# EAGLE design ctrl-brd (EAGLE 7.4.0)
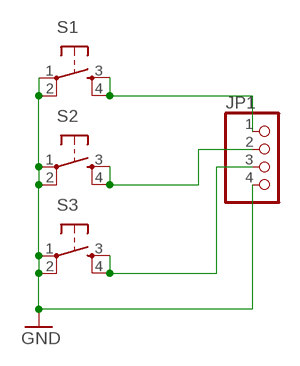
[diagram p0: schematic, sheet 1]

## Parts
JP1  PINHD-1X4  [1X04]
S1  6MM_SWITCH6MM_SWITCH  [6MM_SWITCH]
S2  6MM_SWITCH6MM_SWITCH  [6MM_SWITCH]
S3  6MM_SWITCH6MM_SWITCH  [6MM_SWITCH]

## Nets
GND: JP1.4 S1.1(P) S1.2(P1) S2.1(P) S2.2(P1) S3.1(P) S3.2(P1)
N$4: JP1.1 S1.3(S) S1.4(S1)
N$5: JP1.2 S2.3(S) S2.4(S1)
N$6: JP1.3 S3.3(S) S3.4(S1)

## Library data of the parts
JP1 = pinhead:PINHD-1X4: PIN HEADER
S1-S3 = fab:6MM_SWITCH: OMRON SWITCH

## Board
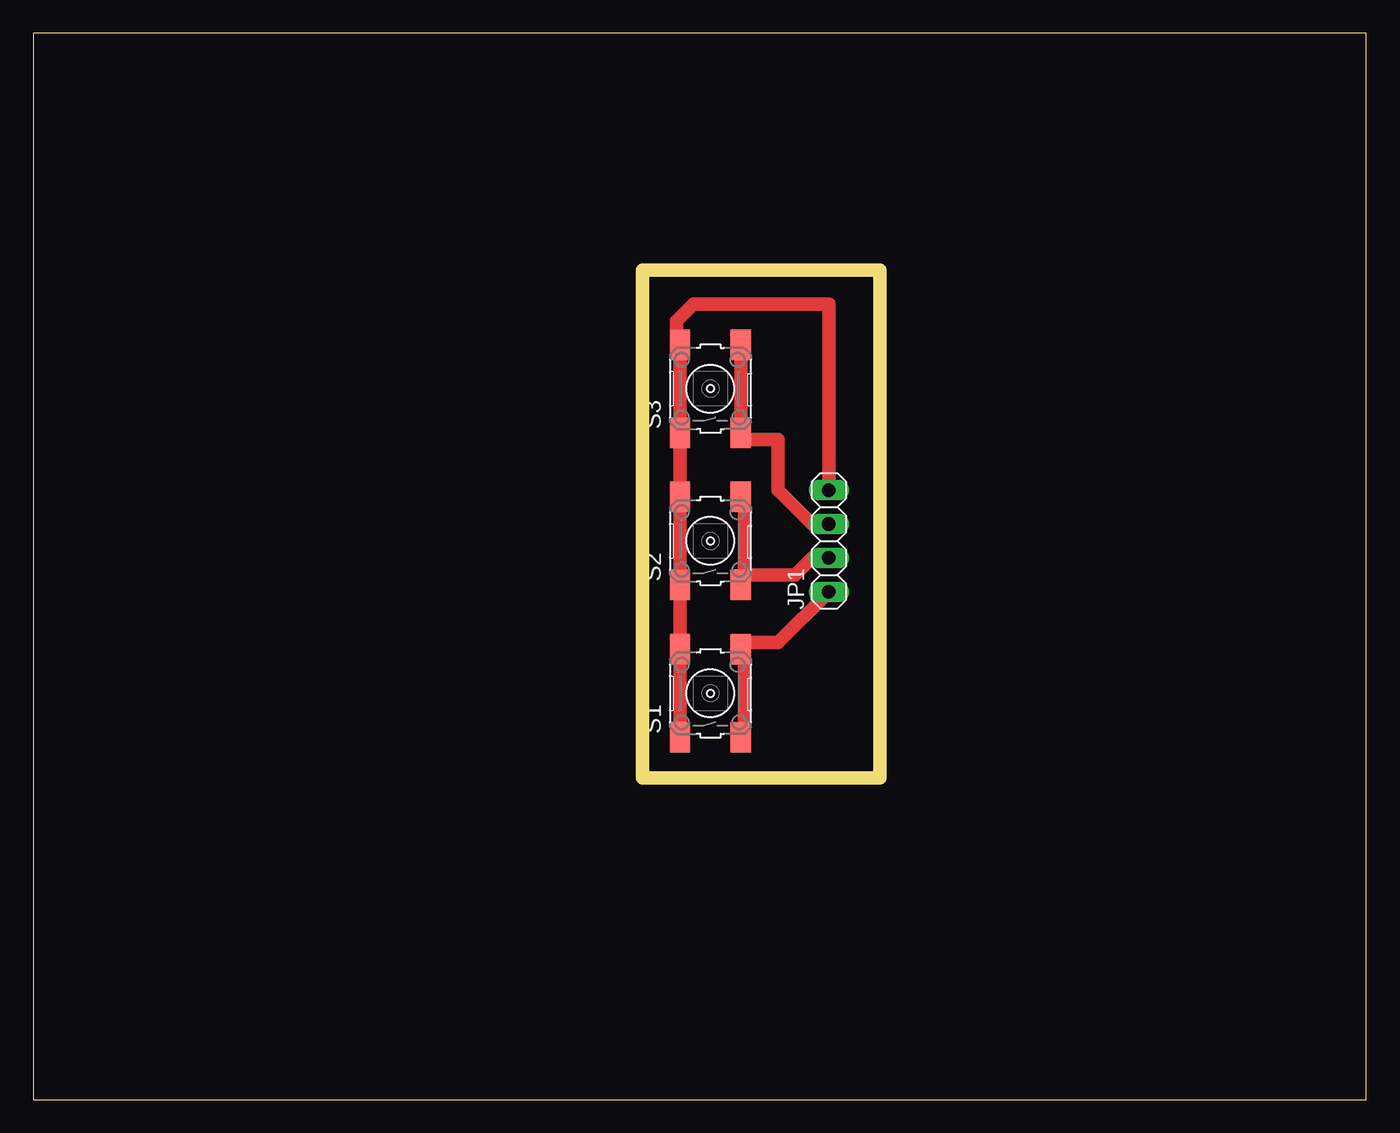
[diagram p1: board, top side]

Size 100 x 80 mm. Coordinates in mm from the lower left corner, seen from the top.
Outline: 0,0 100,0 100,80 0,80 0,0
Copper layers (1*16): Top 0.035mm / dielectric 1.5mm / Bottom 0.035mm
Design rules "default": minimum track width 10mil, minimum drill 24mil, track to track 8mil, track to pad 8mil, pad to pad 8mil, via to via 8mil, smd to smd 8mil, copper to edge 40mil, drill to drill 8mil, minimum pad ring 10mil, minimum via ring 8mil, stop-mask expansion 4mil, vias tented up to drill 0mil, thermal gap 10mil
Milling: 4 lines

### Footprints (pad centres in the part's own frame; a part is rotated, then mirrored left to right if it is on the bottom)
1X04 = drill 1.016 long: 1 -3.81,0; 2 -1.27,0; 3 1.27,0; 4 3.81,0
6MM_SWITCH = smd 2.286 x 1.524: 1 -3.302,2.286; 2 3.302,2.286; 3 -3.302,-2.286; 4 3.302,-2.286

### Placement (x,y rotation side)
JP1  59.69,41.91 90 top
S1  50.8,30.48 90 top
S2  50.8,41.91 90 top
S3  50.8,53.34 90 top

### Tracks (layer width: path | path; a pad name or v marks a point on that pad's centre or on a via)
GND
  Top 1.016: S1.1 S1.2 S2.1 S2.2 S3.1 S3.2 48.26,57.15 48.26,58.42 49.53,59.69 59.69,59.69 JP1.4
N$4
  Top 1.016: JP1.1 55.88,34.29 53.34,34.29 S1.4 53.34,33.02 53.34,27.94 S1.3
N$5
  Top 1.016: 53.34,39.37 53.34,44.45 S2.4 | 53.34,39.37 S2.3 | 53.34,39.37 57.15,39.37 58.42,40.64 JP1.2
N$6
  Top 1.016: S3.4 S3.3 53.34,49.53 55.88,49.53 55.88,45.72 58.42,43.18 JP1.3